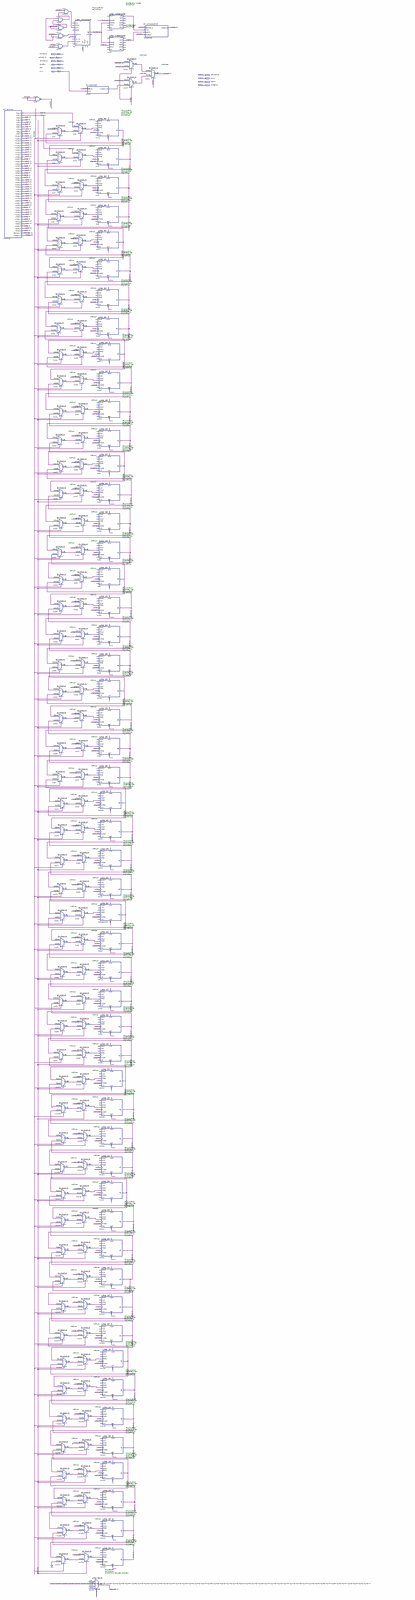
[diagram p0: schematic sheet, whole]
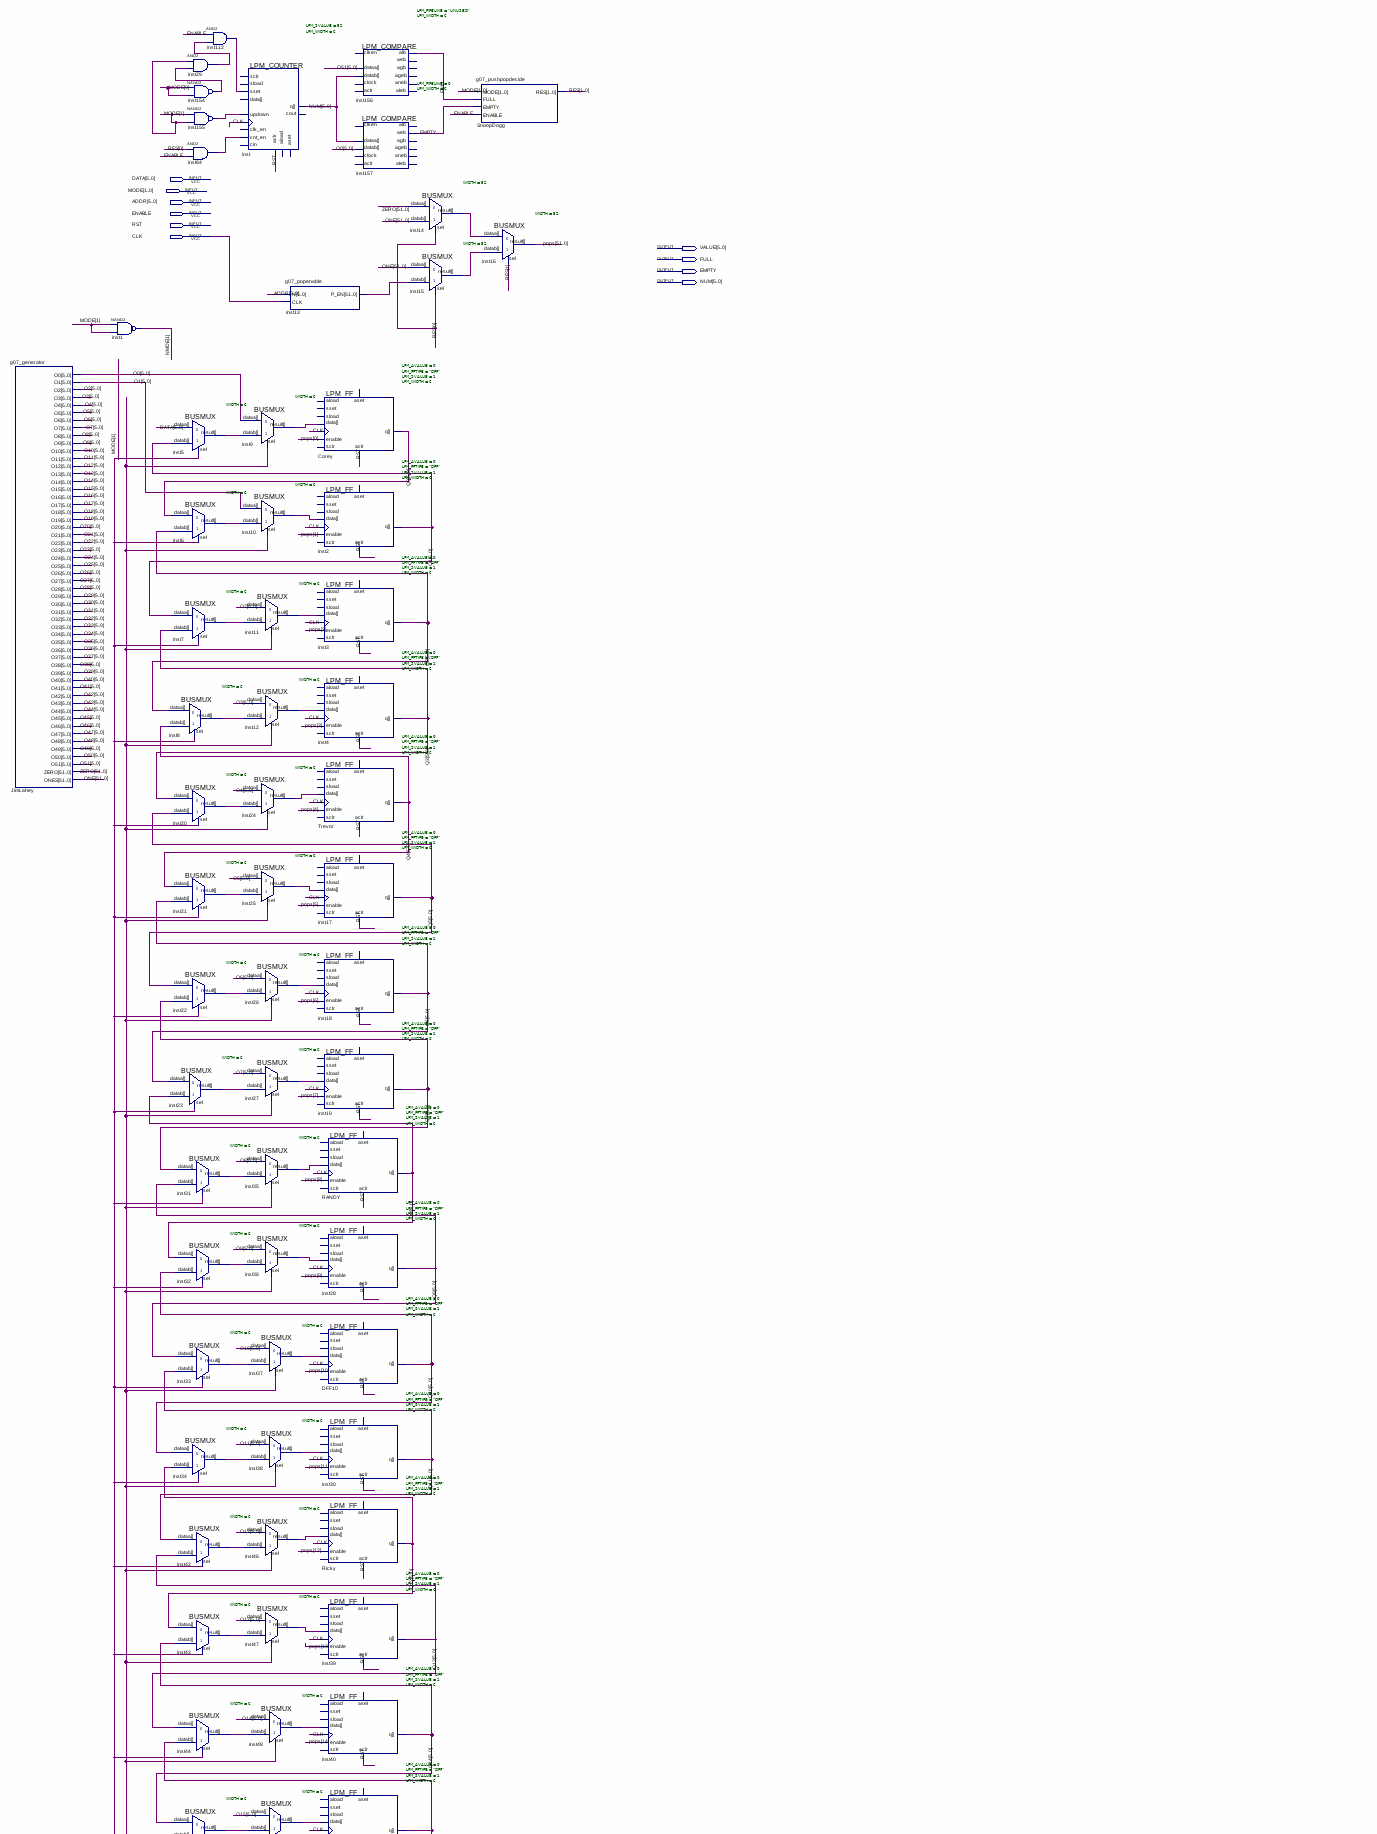
[diagram p1: schematic sheet, upper part]
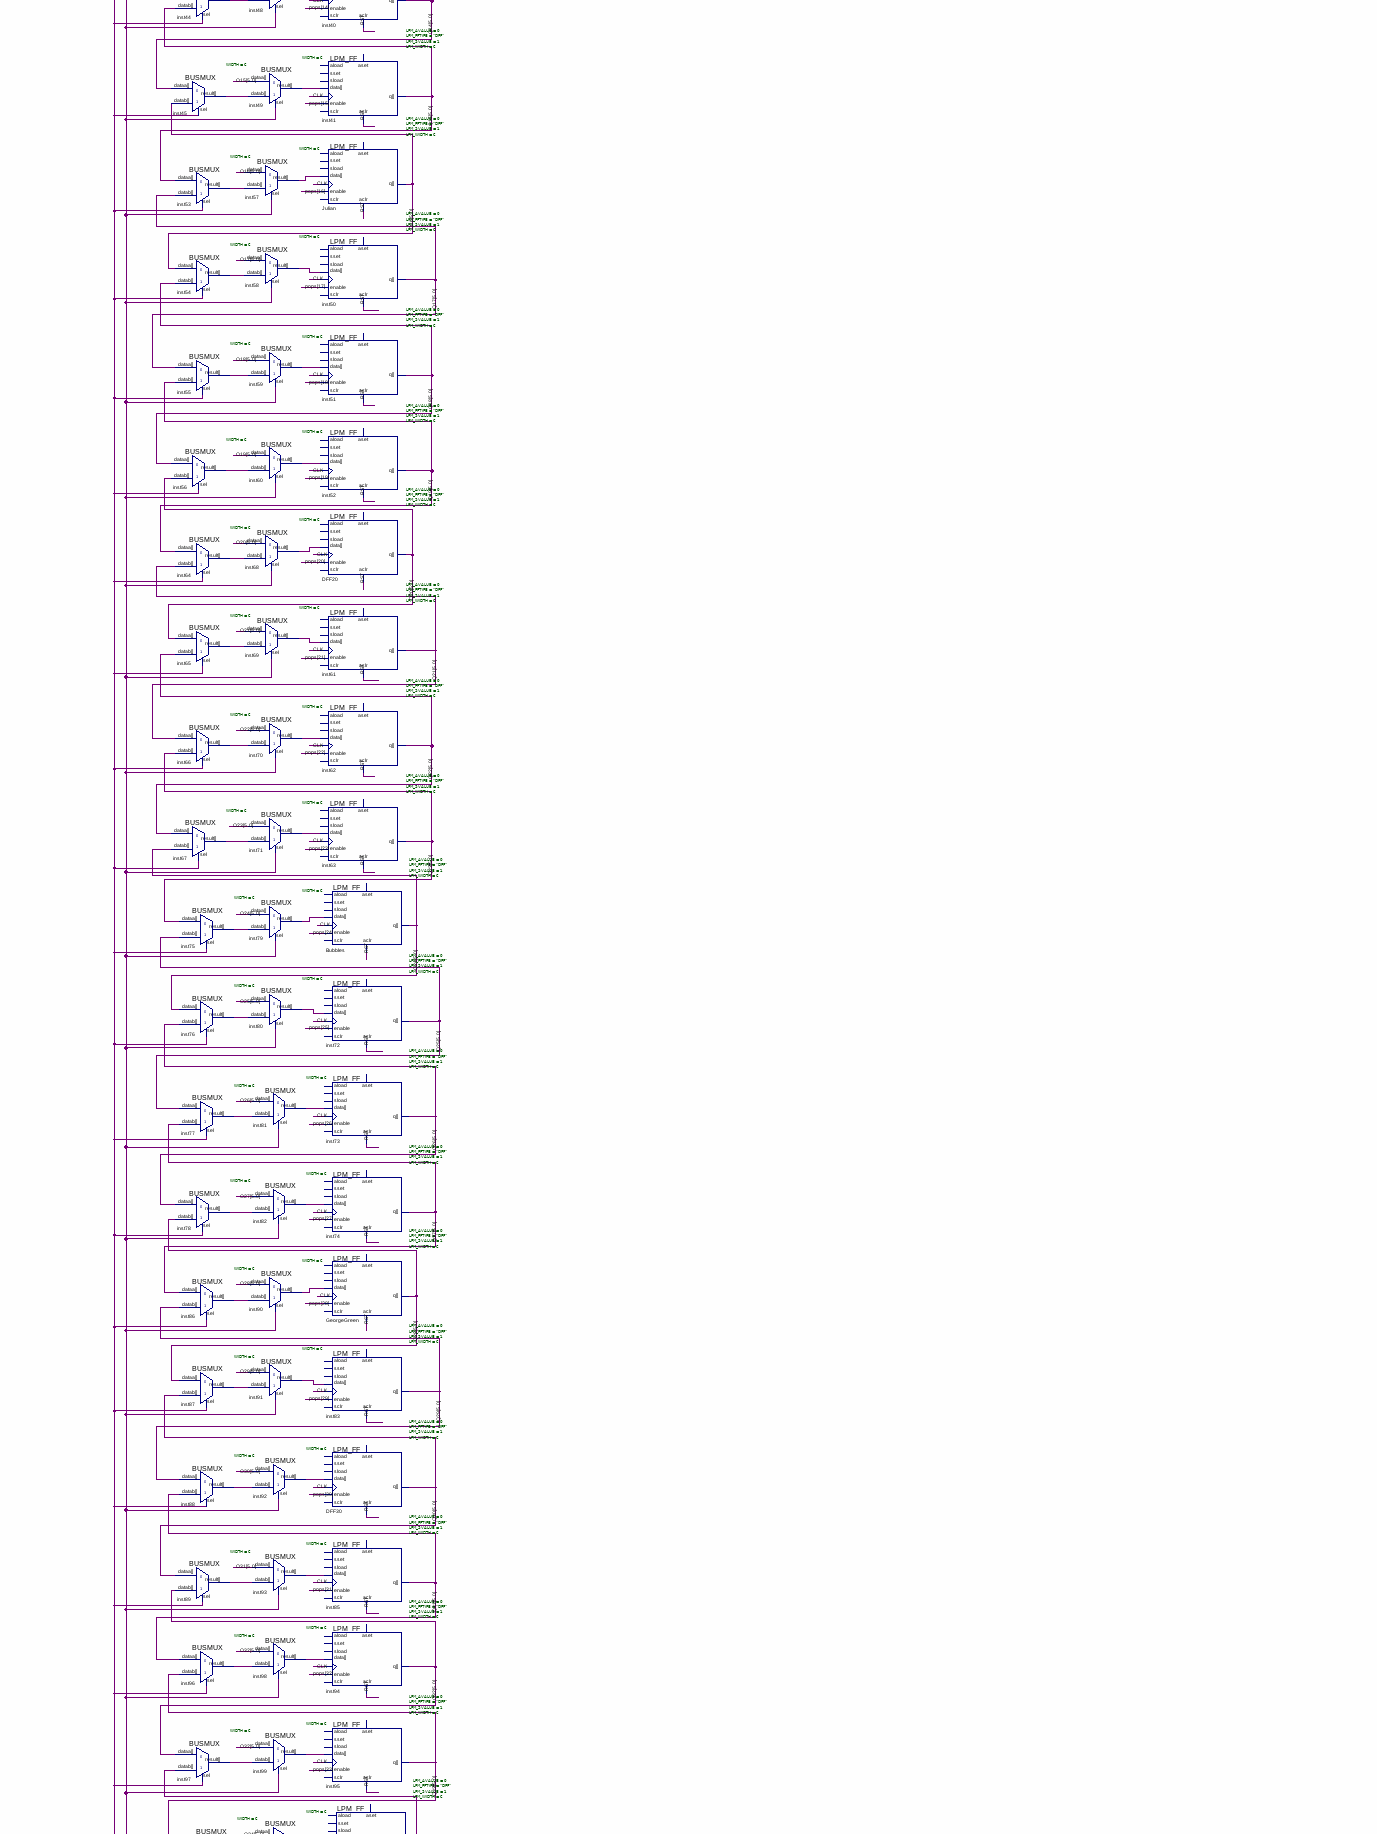
[diagram p2: schematic sheet, middle part]
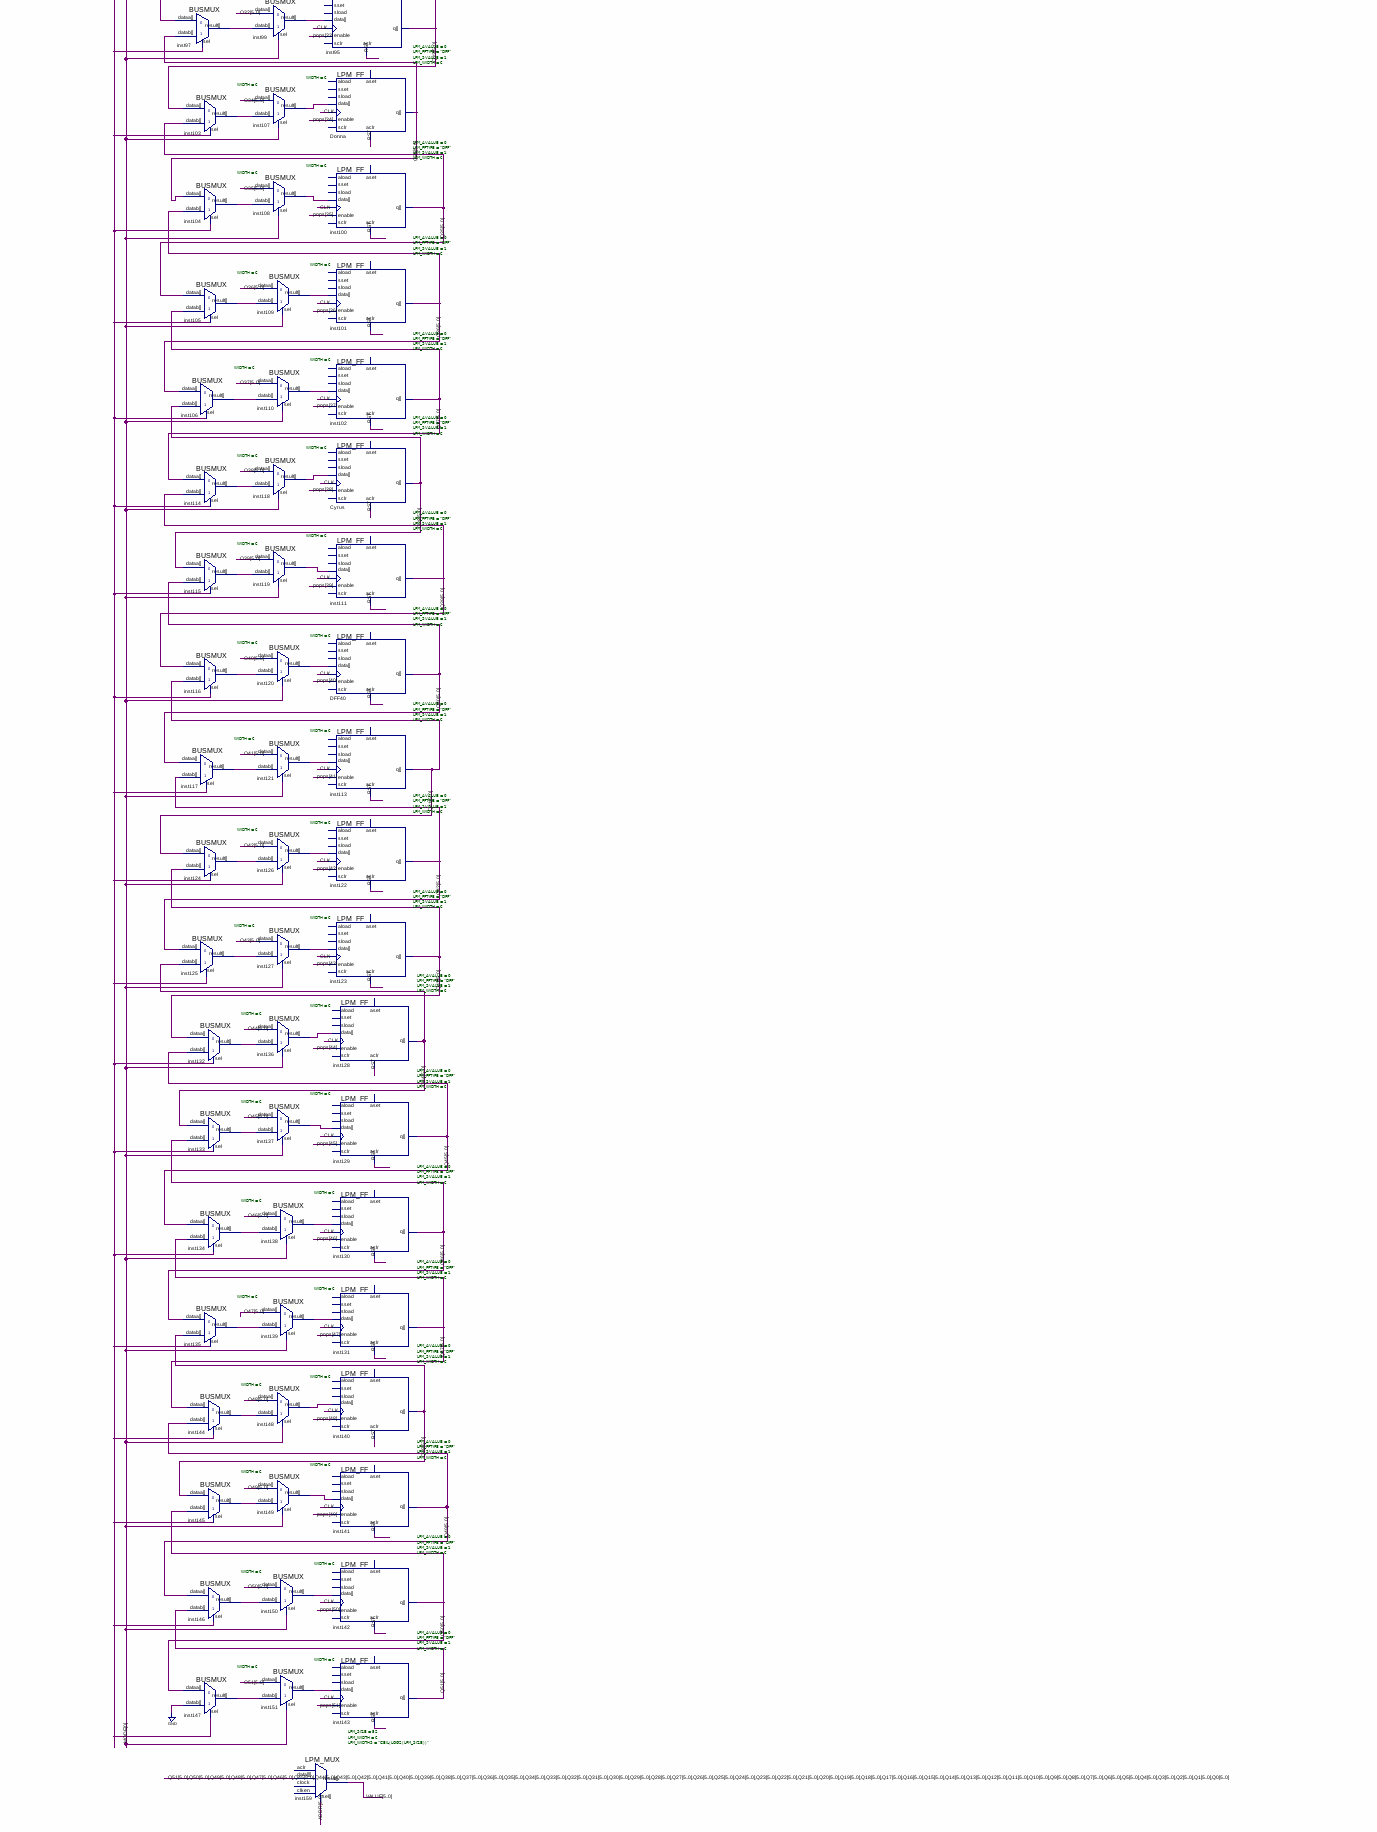
[diagram p3: schematic sheet, lower part]
// Quartus schematic g07_stack.bdf as structural Verilog: 172 symbols, 10 pins
module g07_stack (
  input  [5:0] DATA,
  input  [1:0] MODE,
  input  [5:0] ADDR,
  input  ENABLE,
  input  RST,
  input  CLK,
  output [5:0] VALUE,
  output FULL,
  output EMPTY,
  output [5:0] NUM
);

  wire inst29_out, inst84_out, inst112_out, inst154_out, inst155_out;
  wire [1:0] RES;
  wire [1:1] NMDE;
  wire [5:0] inst5_result, inst6_result, inst7_result, inst8_result, inst9_result, inst10_result,
       inst11_result, inst12_result, inst20_result, inst21_result, inst22_result, inst23_result,
       inst24_result, inst25_result, inst26_result, inst27_result, inst31_result, inst32_result,
       inst33_result, inst34_result, inst35_result, inst36_result, inst37_result, inst38_result,
       inst42_result, inst43_result, inst44_result, inst45_result, inst46_result, inst47_result,
       inst48_result, inst49_result, inst53_result, inst54_result, inst55_result, inst56_result,
       inst57_result, inst58_result, inst59_result, inst60_result, inst64_result, inst65_result,
       inst66_result, inst67_result, inst68_result, inst69_result, inst70_result, inst71_result,
       inst75_result, inst76_result, inst77_result, inst78_result, inst79_result, inst80_result,
       inst81_result, inst82_result, inst86_result, inst87_result, inst88_result, inst89_result,
       inst90_result, inst91_result, inst92_result, inst93_result, inst96_result, inst97_result,
       inst98_result, inst99_result, inst103_result, inst104_result, inst105_result, inst106_result,
       inst107_result, inst108_result, inst109_result, inst110_result, inst114_result, inst115_result,
       inst116_result, inst117_result, inst118_result, inst119_result, inst120_result, inst121_result,
       inst124_result, inst125_result, inst126_result, inst127_result, inst132_result, inst133_result,
       inst134_result, inst135_result, inst136_result, inst137_result, inst138_result, inst139_result,
       inst144_result, inst145_result, inst146_result, inst147_result, inst148_result, inst149_result,
       inst150_result, inst151_result, O0, O1, O2, O3, O4, O5, O6, O7, O8, O9, O10, O11, O12, O13, O14, O15,
       O16, O17, O18, O19, O20, O21, O22, O23, O24, O25, O26, O27, O28, O29, O30, O31, O32, O33, O34, O35,
       O36, O37, O38, O39, O40, O41, O42, O43, O44, O45, O46, O47, O48, O49, O50, O51, Q0, Q1, Q2, Q3, Q4,
       Q5, Q6, Q7, Q8, Q9, Q10, Q11, Q12, Q13, Q14, Q15, Q16, Q17, Q18, Q19, Q20, Q21, Q22, Q23, Q24, Q25,
       Q26, Q27, Q28, Q29, Q30, Q31, Q32, Q33, Q34, Q35, Q36, Q37, Q38, Q39, Q40, Q41, Q42, Q43, Q44, Q45,
       Q46, Q47, Q48, Q49, Q50, Q51;
  wire [51:0] inst13_p_en, inst14_result, inst15_result, ONE, pops, ZERO;

  g07_generator JimLahey (
    .O0(O0), .O1(O1), .O2(O2), .O3(O3), .O4(O4), .O5(O5), .O6(O6), .O7(O7), .O8(O8), .O9(O9), .O10(O10),
    .O11(O11), .O12(O12), .O13(O13), .O14(O14), .O15(O15), .O16(O16), .O17(O17), .O18(O18), .O19(O19),
    .O20(O20), .O21(O21), .O22(O22), .O23(O23), .O24(O24), .O25(O25), .O26(O26), .O27(O27), .O28(O28),
    .O29(O29), .O30(O30), .O31(O31), .O32(O32), .O33(O33), .O34(O34), .O35(O35), .O36(O36), .O37(O37),
    .O38(O38), .O39(O39), .O40(O40), .O41(O41), .O42(O42), .O43(O43), .O44(O44), .O45(O45), .O46(O46),
    .O47(O47), .O48(O48), .O49(O49), .O50(O50), .O51(O51), .ZERO(ZERO), .ONES(ONE));
  nand inst1 (NMDE[1], MODE[1], MODE[1]);
  BUSMUX #(.WIDTH(6)) inst5 (.datab(Q1), .sel(MODE[1]), .dataa(DATA), .result(inst5_result));
  BUSMUX #(.WIDTH(6)) inst6 (.datab(Q2), .sel(MODE[1]), .dataa(Q0), .result(inst6_result));
  BUSMUX #(.WIDTH(6)) inst7 (.datab(Q3), .sel(MODE[1]), .dataa(Q1), .result(inst7_result));
  BUSMUX #(.WIDTH(6)) inst8 (.datab(Q4), .sel(MODE[1]), .dataa(Q2), .result(inst8_result));
  BUSMUX #(.WIDTH(6)) inst20 (.datab(Q5), .sel(MODE[1]), .dataa(Q3), .result(inst20_result));
  BUSMUX #(.WIDTH(6)) inst21 (.datab(Q6), .sel(MODE[1]), .dataa(Q4), .result(inst21_result));
  BUSMUX #(.WIDTH(6)) inst22 (.datab(Q7), .sel(MODE[1]), .dataa(Q5), .result(inst22_result));
  BUSMUX #(.WIDTH(6)) inst23 (.datab(Q8), .sel(MODE[1]), .dataa(Q6), .result(inst23_result));
  BUSMUX #(.WIDTH(6)) inst34 (.datab(Q12), .sel(MODE[1]), .dataa(Q10), .result(inst34_result));
  BUSMUX #(.WIDTH(6)) inst45 (.datab(Q16), .sel(MODE[1]), .dataa(Q14), .result(inst45_result));
  BUSMUX #(.WIDTH(6)) inst56 (.datab(Q20), .sel(MODE[1]), .dataa(Q18), .result(inst56_result));
  BUSMUX #(.WIDTH(6)) inst67 (.datab(Q24), .sel(MODE[1]), .dataa(Q22), .result(inst67_result));
  and inst29 (inst29_out, MODE[1], inst154_out);
  nand inst154 (inst154_out, MODE[0], MODE[0]);
  nand inst155 (inst155_out, MODE[1], MODE[1]);
  and inst84 (inst84_out, RES[0], ENABLE);
  BUSMUX #(.WIDTH(6)) inst31 (.datab(Q9), .sel(MODE[1]), .dataa(Q7), .result(inst31_result));
  BUSMUX #(.WIDTH(6)) inst32 (.datab(Q10), .sel(MODE[1]), .dataa(Q8), .result(inst32_result));
  BUSMUX #(.WIDTH(6)) inst33 (.datab(Q11), .sel(MODE[1]), .dataa(Q9), .result(inst33_result));
  BUSMUX #(.WIDTH(6)) inst42 (.datab(Q13), .sel(MODE[1]), .dataa(Q11), .result(inst42_result));
  BUSMUX #(.WIDTH(6)) inst43 (.datab(Q14), .sel(MODE[1]), .dataa(Q12), .result(inst43_result));
  BUSMUX #(.WIDTH(6)) inst44 (.datab(Q15), .sel(MODE[1]), .dataa(Q13), .result(inst44_result));
  BUSMUX #(.WIDTH(6)) inst53 (.datab(Q17), .sel(MODE[1]), .dataa(Q15), .result(inst53_result));
  BUSMUX #(.WIDTH(6)) inst54 (.datab(Q18), .sel(MODE[1]), .dataa(Q16), .result(inst54_result));
  BUSMUX #(.WIDTH(6)) inst55 (.datab(Q19), .sel(MODE[1]), .dataa(Q17), .result(inst55_result));
  BUSMUX #(.WIDTH(6)) inst64 (.datab(Q21), .sel(MODE[1]), .dataa(Q19), .result(inst64_result));
  BUSMUX #(.WIDTH(6)) inst65 (.datab(Q22), .sel(MODE[1]), .dataa(Q20), .result(inst65_result));
  BUSMUX #(.WIDTH(6)) inst66 (.datab(Q23), .sel(MODE[1]), .dataa(Q21), .result(inst66_result));
  BUSMUX #(.WIDTH(6)) inst75 (.datab(Q25), .sel(MODE[1]), .dataa(Q23), .result(inst75_result));
  BUSMUX #(.WIDTH(6)) inst76 (.datab(Q26), .sel(MODE[1]), .dataa(Q24), .result(inst76_result));
  BUSMUX #(.WIDTH(6)) inst77 (.datab(Q27), .sel(MODE[1]), .dataa(Q25), .result(inst77_result));
  BUSMUX #(.WIDTH(6)) inst78 (.datab(Q28), .sel(MODE[1]), .dataa(Q26), .result(inst78_result));
  BUSMUX #(.WIDTH(6)) inst86 (.datab(Q29), .sel(MODE[1]), .dataa(Q27), .result(inst86_result));
  BUSMUX #(.WIDTH(6)) inst87 (.datab(Q30), .sel(MODE[1]), .dataa(Q28), .result(inst87_result));
  BUSMUX #(.WIDTH(6)) inst88 (.datab(Q31), .sel(MODE[1]), .dataa(Q29), .result(inst88_result));
  BUSMUX #(.WIDTH(6)) inst89 (.datab(Q32), .sel(MODE[1]), .dataa(Q30), .result(inst89_result));
  BUSMUX #(.WIDTH(6)) inst96 (.datab(Q33), .sel(MODE[1]), .dataa(Q31), .result(inst96_result));
  BUSMUX #(.WIDTH(6)) inst97 (.datab(Q34), .sel(MODE[1]), .dataa(Q32), .result(inst97_result));
  BUSMUX #(.WIDTH(6)) inst103 (.datab(Q35), .sel(MODE[1]), .dataa(Q33), .result(inst103_result));
  BUSMUX #(.WIDTH(6)) inst104 (.datab(Q36), .sel(MODE[1]), .dataa(Q34), .result(inst104_result));
  BUSMUX #(.WIDTH(6)) inst105 (.datab(Q37), .sel(MODE[1]), .dataa(Q35), .result(inst105_result));
  BUSMUX #(.WIDTH(6)) inst106 (.datab(Q38), .sel(MODE[1]), .dataa(Q36), .result(inst106_result));
  BUSMUX #(.WIDTH(6)) inst114 (.datab(Q39), .sel(MODE[1]), .dataa(Q37), .result(inst114_result));
  BUSMUX #(.WIDTH(6)) inst115 (.datab(Q40), .sel(MODE[1]), .dataa(Q38), .result(inst115_result));
  BUSMUX #(.WIDTH(6)) inst116 (.datab(Q41), .sel(MODE[1]), .dataa(Q39), .result(inst116_result));
  BUSMUX #(.WIDTH(6)) inst117 (.datab(Q42), .sel(MODE[1]), .dataa(Q40), .result(inst117_result));
  BUSMUX #(.WIDTH(6)) inst124 (.datab(Q43), .sel(MODE[1]), .dataa(Q41), .result(inst124_result));
  BUSMUX #(.WIDTH(6)) inst125 (.datab(Q44), .sel(MODE[1]), .dataa(Q42), .result(inst125_result));
  BUSMUX #(.WIDTH(6)) inst132 (.datab(Q45), .sel(MODE[1]), .dataa(Q43), .result(inst132_result));
  BUSMUX #(.WIDTH(6)) inst133 (.datab(Q46), .sel(MODE[1]), .dataa(Q44), .result(inst133_result));
  BUSMUX #(.WIDTH(6)) inst134 (.datab(Q47), .sel(MODE[1]), .dataa(Q45), .result(inst134_result));
  BUSMUX #(.WIDTH(6)) inst135 (.datab(Q48), .sel(MODE[1]), .dataa(Q46), .result(inst135_result));
  BUSMUX #(.WIDTH(6)) inst144 (.datab(Q49), .sel(MODE[1]), .dataa(Q47), .result(inst144_result));
  BUSMUX #(.WIDTH(6)) inst145 (.datab(Q50), .sel(MODE[1]), .dataa(Q48), .result(inst145_result));
  BUSMUX #(.WIDTH(6)) inst146 (.datab(Q51), .sel(MODE[1]), .dataa(Q49), .result(inst146_result));
  BUSMUX #(.WIDTH(6)) inst147 (.datab({6{1'b0}}), .sel(MODE[1]), .dataa(Q50), .result(inst147_result));
  and inst112 (inst112_out, ENABLE, inst29_out);
  LPM_COUNTER #(.LPM_SVALUE(52), .LPM_WIDTH(6)) inst (
    .clock(CLK), .aclr(RST), .sset(inst112_out), .updown(inst155_out), .cnt_en(inst84_out), .q(NUM));  // open: sload, data, clk_en, aload, aset, cin, sclr, cout
  BUSMUX #(.WIDTH(6)) inst9 (.datab(inst5_result), .sel(MODE[0]), .dataa(O0), .result(inst9_result));
  BUSMUX #(.WIDTH(6)) inst10 (.datab(inst6_result), .sel(MODE[0]), .dataa(O1), .result(inst10_result));
  BUSMUX #(.WIDTH(6)) inst11 (.datab(inst7_result), .sel(MODE[0]), .dataa(O2), .result(inst11_result));
  BUSMUX #(.WIDTH(6)) inst12 (.datab(inst8_result), .sel(MODE[0]), .dataa(O3), .result(inst12_result));
  BUSMUX #(.WIDTH(6)) inst24 (.datab(inst20_result), .sel(MODE[0]), .dataa(O4), .result(inst24_result));
  BUSMUX #(.WIDTH(6)) inst25 (.datab(inst21_result), .sel(MODE[0]), .dataa(O5), .result(inst25_result));
  BUSMUX #(.WIDTH(6)) inst26 (.datab(inst22_result), .sel(MODE[0]), .dataa(O6), .result(inst26_result));
  BUSMUX #(.WIDTH(6)) inst27 (.datab(inst23_result), .sel(MODE[0]), .dataa(O7), .result(inst27_result));
  BUSMUX #(.WIDTH(6)) inst35 (.datab(inst31_result), .sel(MODE[0]), .dataa(O8), .result(inst35_result));
  BUSMUX #(.WIDTH(6)) inst36 (.datab(inst32_result), .sel(MODE[0]), .dataa(O9), .result(inst36_result));
  BUSMUX #(.WIDTH(6)) inst37 (.datab(inst33_result), .sel(MODE[0]), .dataa(O10), .result(inst37_result));
  BUSMUX #(.WIDTH(6)) inst38 (.datab(inst34_result), .sel(MODE[0]), .dataa(O11), .result(inst38_result));
  BUSMUX #(.WIDTH(6)) inst46 (.datab(inst42_result), .sel(MODE[0]), .dataa(O12), .result(inst46_result));
  BUSMUX #(.WIDTH(6)) inst47 (.datab(inst43_result), .sel(MODE[0]), .dataa(O13), .result(inst47_result));
  BUSMUX #(.WIDTH(6)) inst48 (.datab(inst44_result), .sel(MODE[0]), .dataa(O14), .result(inst48_result));
  BUSMUX #(.WIDTH(6)) inst49 (.datab(inst45_result), .sel(MODE[0]), .dataa(O15), .result(inst49_result));
  BUSMUX #(.WIDTH(6)) inst57 (.datab(inst53_result), .sel(MODE[0]), .dataa(O16), .result(inst57_result));
  BUSMUX #(.WIDTH(6)) inst58 (.datab(inst54_result), .sel(MODE[0]), .dataa(O17), .result(inst58_result));
  BUSMUX #(.WIDTH(6)) inst59 (.datab(inst55_result), .sel(MODE[0]), .dataa(O18), .result(inst59_result));
  BUSMUX #(.WIDTH(6)) inst60 (.datab(inst56_result), .sel(MODE[0]), .dataa(O19), .result(inst60_result));
  BUSMUX #(.WIDTH(6)) inst68 (.datab(inst64_result), .sel(MODE[0]), .dataa(O20), .result(inst68_result));
  BUSMUX #(.WIDTH(6)) inst69 (.datab(inst65_result), .sel(MODE[0]), .dataa(O21), .result(inst69_result));
  BUSMUX #(.WIDTH(6)) inst70 (.datab(inst66_result), .sel(MODE[0]), .dataa(O22), .result(inst70_result));
  BUSMUX #(.WIDTH(6)) inst71 (.datab(inst67_result), .sel(MODE[0]), .dataa(O23), .result(inst71_result));
  BUSMUX #(.WIDTH(6)) inst79 (.datab(inst75_result), .sel(MODE[0]), .dataa(O24), .result(inst79_result));
  BUSMUX #(.WIDTH(6)) inst80 (.datab(inst76_result), .sel(MODE[0]), .dataa(O25), .result(inst80_result));
  BUSMUX #(.WIDTH(6)) inst81 (.datab(inst77_result), .sel(MODE[0]), .dataa(O26), .result(inst81_result));
  BUSMUX #(.WIDTH(6)) inst82 (.datab(inst78_result), .sel(MODE[0]), .dataa(O27), .result(inst82_result));
  BUSMUX #(.WIDTH(6)) inst90 (.datab(inst86_result), .sel(MODE[0]), .dataa(O28), .result(inst90_result));
  BUSMUX #(.WIDTH(6)) inst91 (.datab(inst87_result), .sel(MODE[0]), .dataa(O29), .result(inst91_result));
  BUSMUX #(.WIDTH(6)) inst92 (.datab(inst88_result), .sel(MODE[0]), .dataa(O30), .result(inst92_result));
  BUSMUX #(.WIDTH(6)) inst93 (.datab(inst89_result), .sel(MODE[0]), .dataa(O31), .result(inst93_result));
  BUSMUX #(.WIDTH(6)) inst98 (.datab(inst96_result), .sel(MODE[0]), .dataa(O32), .result(inst98_result));
  BUSMUX #(.WIDTH(6)) inst99 (.datab(inst97_result), .sel(MODE[0]), .dataa(O32), .result(inst99_result));
  BUSMUX #(.WIDTH(6)) inst107 (.datab(inst103_result), .sel(MODE[0]), .dataa(O34), .result(inst107_result));
  BUSMUX #(.WIDTH(6)) inst108 (.datab(inst104_result), .sel(MODE[0]), .dataa(O35), .result(inst108_result));
  BUSMUX #(.WIDTH(6)) inst109 (.datab(inst105_result), .sel(MODE[0]), .dataa(O36), .result(inst109_result));
  BUSMUX #(.WIDTH(6)) inst110 (.datab(inst106_result), .sel(MODE[0]), .dataa(O37), .result(inst110_result));
  BUSMUX #(.WIDTH(6)) inst118 (.datab(inst114_result), .sel(MODE[0]), .dataa(O38), .result(inst118_result));
  BUSMUX #(.WIDTH(6)) inst119 (.datab(inst115_result), .sel(MODE[0]), .dataa(O39), .result(inst119_result));
  BUSMUX #(.WIDTH(6)) inst120 (.datab(inst116_result), .sel(MODE[0]), .dataa(O40), .result(inst120_result));
  BUSMUX #(.WIDTH(6)) inst121 (.datab(inst117_result), .sel(MODE[0]), .dataa(O41), .result(inst121_result));
  BUSMUX #(.WIDTH(6)) inst126 (.datab(inst124_result), .sel(MODE[0]), .dataa(O42), .result(inst126_result));
  BUSMUX #(.WIDTH(6)) inst127 (.datab(inst125_result), .sel(MODE[0]), .dataa(O43), .result(inst127_result));
  BUSMUX #(.WIDTH(6)) inst136 (.datab(inst132_result), .sel(MODE[0]), .dataa(O44), .result(inst136_result));
  BUSMUX #(.WIDTH(6)) inst137 (.datab(inst133_result), .sel(MODE[0]), .dataa(O45), .result(inst137_result));
  BUSMUX #(.WIDTH(6)) inst138 (.datab(inst134_result), .sel(MODE[0]), .dataa(O46), .result(inst138_result));
  BUSMUX #(.WIDTH(6)) inst139 (.datab(inst135_result), .sel(MODE[0]), .dataa(O47), .result(inst139_result));
  BUSMUX #(.WIDTH(6)) inst148 (.datab(inst144_result), .sel(MODE[0]), .dataa(O48), .result(inst148_result));
  BUSMUX #(.WIDTH(6)) inst149 (.datab(inst145_result), .sel(MODE[0]), .dataa(O49), .result(inst149_result));
  BUSMUX #(.WIDTH(6)) inst150 (.datab(inst146_result), .sel(MODE[0]), .dataa(O50), .result(inst150_result));
  BUSMUX #(.WIDTH(6)) inst151 (.datab(inst147_result), .sel(MODE[0]), .dataa(O51), .result(inst151_result));
  g07_popenable inst13 (.N(ADDR), .CLK(CLK), .P_EN(inst13_p_en));
  LPM_MUX #(.LPM_SIZE(52), .LPM_WIDTH(6), .LPM_WIDTHS("CEIL(LOG2(LPM_SIZE))")) inst159 (
    .data({Q51, Q50, Q49, Q48, Q47, Q46, Q45, Q44, Q43, Q42, Q41, Q40, Q39, Q38, Q37, Q36, Q35, Q34, Q33, Q32, Q31, Q30, Q29, Q28, Q27, Q26, Q25, Q24, Q23, Q22, Q21, Q20, Q19, Q18, Q17, Q16, Q15, Q14, Q13, Q12, Q11, Q10, Q9, Q8, Q7, Q6, Q5, Q4, Q3, Q2, Q1, Q0}),
    .sel(ADDR), .result(VALUE));  // open: clock, aclr, clken
  LPM_FF #(.LPM_AVALUE(0), .LPM_FFTYPE("DFF"), .LPM_SVALUE(1), .LPM_WIDTH(6)) Corey (
    .enable(pops[0]), .clock(CLK), .aclr(RST), .data(inst9_result), .q(Q0));  // open: aload, sset, sload, aset, sclr
  LPM_FF #(.LPM_AVALUE(0), .LPM_FFTYPE("DFF"), .LPM_SVALUE(1), .LPM_WIDTH(6)) inst2 (
    .enable(pops[1]), .clock(CLK), .aclr(RST), .data(inst10_result), .q(Q1));  // open: aload, sset, sload, aset, sclr
  LPM_FF #(.LPM_AVALUE(0), .LPM_FFTYPE("DFF"), .LPM_SVALUE(1), .LPM_WIDTH(6)) inst3 (
    .enable(pops[2]), .clock(CLK), .aclr(RST), .data(inst11_result), .q(Q2));  // open: aload, sset, sload, aset, sclr
  LPM_FF #(.LPM_AVALUE(0), .LPM_FFTYPE("DFF"), .LPM_SVALUE(1), .LPM_WIDTH(6)) inst4 (
    .enable(pops[3]), .clock(CLK), .aclr(RST), .data(inst12_result), .q(Q3));  // open: aload, sset, sload, aset, sclr
  LPM_FF #(.LPM_AVALUE(0), .LPM_FFTYPE("DFF"), .LPM_SVALUE(1), .LPM_WIDTH(6)) Trevor (
    .enable(pops[4]), .clock(CLK), .aclr(RST), .data(inst24_result), .q(Q4));  // open: aload, sset, sload, aset, sclr
  LPM_FF #(.LPM_AVALUE(0), .LPM_FFTYPE("DFF"), .LPM_SVALUE(1), .LPM_WIDTH(6)) inst17 (
    .enable(pops[5]), .clock(CLK), .aclr(RST), .data(inst25_result), .q(Q5));  // open: aload, sset, sload, aset, sclr
  LPM_FF #(.LPM_AVALUE(0), .LPM_FFTYPE("DFF"), .LPM_SVALUE(1), .LPM_WIDTH(6)) inst18 (
    .enable(pops[6]), .clock(CLK), .aclr(RST), .data(inst26_result), .q(Q6));  // open: aload, sset, sload, aset, sclr
  LPM_FF #(.LPM_AVALUE(0), .LPM_FFTYPE("DFF"), .LPM_SVALUE(1), .LPM_WIDTH(6)) inst19 (
    .enable(pops[7]), .clock(CLK), .aclr(RST), .data(inst27_result), .q(Q7));  // open: aload, sset, sload, aset, sclr
  LPM_FF #(.LPM_AVALUE(0), .LPM_FFTYPE("DFF"), .LPM_SVALUE(1), .LPM_WIDTH(6)) RANDY (
    .enable(pops[8]), .clock(CLK), .aclr(RST), .data(inst35_result), .q(Q8));  // open: aload, sset, sload, aset, sclr
  LPM_FF #(.LPM_AVALUE(0), .LPM_FFTYPE("DFF"), .LPM_SVALUE(1), .LPM_WIDTH(6)) inst28 (
    .enable(pops[9]), .clock(CLK), .aclr(RST), .data(inst36_result), .q(Q9));  // open: aload, sset, sload, aset, sclr
  LPM_FF #(.LPM_AVALUE(0), .LPM_FFTYPE("DFF"), .LPM_SVALUE(1), .LPM_WIDTH(6)) DFF10 (
    .enable(pops[10]), .clock(CLK), .aclr(RST), .data(inst37_result), .q(Q10));  // open: aload, sset, sload, aset, sclr
  LPM_FF #(.LPM_AVALUE(0), .LPM_FFTYPE("DFF"), .LPM_SVALUE(1), .LPM_WIDTH(6)) inst30 (
    .enable(pops[11]), .clock(CLK), .aclr(RST), .data(inst38_result), .q(Q11));  // open: aload, sset, sload, aset, sclr
  LPM_FF #(.LPM_AVALUE(0), .LPM_FFTYPE("DFF"), .LPM_SVALUE(1), .LPM_WIDTH(6)) Ricky (
    .enable(pops[12]), .clock(CLK), .aclr(RST), .data(inst46_result), .q(Q12));  // open: aload, sset, sload, aset, sclr
  LPM_FF #(.LPM_AVALUE(0), .LPM_FFTYPE("DFF"), .LPM_SVALUE(1), .LPM_WIDTH(6)) inst39 (
    .enable(pops[13]), .clock(CLK), .aclr(RST), .data(inst47_result), .q(Q13));  // open: aload, sset, sload, aset, sclr
  LPM_FF #(.LPM_AVALUE(0), .LPM_FFTYPE("DFF"), .LPM_SVALUE(1), .LPM_WIDTH(6)) inst40 (
    .enable(pops[14]), .clock(CLK), .aclr(RST), .data(inst48_result), .q(Q14));  // open: aload, sset, sload, aset, sclr
  LPM_FF #(.LPM_AVALUE(0), .LPM_FFTYPE("DFF"), .LPM_SVALUE(1), .LPM_WIDTH(6)) inst41 (
    .enable(pops[15]), .clock(CLK), .aclr(RST), .data(inst49_result), .q(Q15));  // open: aload, sset, sload, aset, sclr
  LPM_FF #(.LPM_AVALUE(0), .LPM_FFTYPE("DFF"), .LPM_SVALUE(1), .LPM_WIDTH(6)) Julian (
    .enable(pops[16]), .clock(CLK), .aclr(RST), .data(inst57_result), .q(Q16));  // open: aload, sset, sload, aset, sclr
  LPM_FF #(.LPM_AVALUE(0), .LPM_FFTYPE("DFF"), .LPM_SVALUE(1), .LPM_WIDTH(6)) inst50 (
    .enable(pops[17]), .clock(CLK), .aclr(RST), .data(inst58_result), .q(Q17));  // open: aload, sset, sload, aset, sclr
  LPM_FF #(.LPM_AVALUE(0), .LPM_FFTYPE("DFF"), .LPM_SVALUE(1), .LPM_WIDTH(6)) inst51 (
    .enable(pops[18]), .clock(CLK), .aclr(RST), .data(inst59_result), .q(Q18));  // open: aload, sset, sload, aset, sclr
  LPM_FF #(.LPM_AVALUE(0), .LPM_FFTYPE("DFF"), .LPM_SVALUE(1), .LPM_WIDTH(6)) inst52 (
    .enable(pops[19]), .clock(CLK), .aclr(RST), .data(inst60_result), .q(Q19));  // open: aload, sset, sload, aset, sclr
  LPM_FF #(.LPM_AVALUE(0), .LPM_FFTYPE("DFF"), .LPM_SVALUE(1), .LPM_WIDTH(6)) DFF20 (
    .enable(pops[20]), .clock(CLK), .aclr(RST), .data(inst68_result), .q(Q20));  // open: aload, sset, sload, aset, sclr
  LPM_FF #(.LPM_AVALUE(0), .LPM_FFTYPE("DFF"), .LPM_SVALUE(1), .LPM_WIDTH(6)) inst61 (
    .enable(pops[21]), .clock(CLK), .aclr(RST), .data(inst69_result), .q(Q21));  // open: aload, sset, sload, aset, sclr
  LPM_FF #(.LPM_AVALUE(0), .LPM_FFTYPE("DFF"), .LPM_SVALUE(1), .LPM_WIDTH(6)) inst62 (
    .enable(pops[22]), .clock(CLK), .aclr(RST), .data(inst70_result), .q(Q22));  // open: aload, sset, sload, aset, sclr
  LPM_FF #(.LPM_AVALUE(0), .LPM_FFTYPE("DFF"), .LPM_SVALUE(1), .LPM_WIDTH(6)) inst63 (
    .enable(pops[23]), .clock(CLK), .aclr(RST), .data(inst71_result), .q(Q23));  // open: aload, sset, sload, aset, sclr
  LPM_FF #(.LPM_AVALUE(0), .LPM_FFTYPE("DFF"), .LPM_SVALUE(1), .LPM_WIDTH(6)) Bubbles (
    .enable(pops[24]), .clock(CLK), .aclr(RST), .data(inst79_result), .q(Q24));  // open: aload, sset, sload, aset, sclr
  LPM_FF #(.LPM_AVALUE(0), .LPM_FFTYPE("DFF"), .LPM_SVALUE(1), .LPM_WIDTH(6)) inst72 (
    .enable(pops[25]), .clock(CLK), .aclr(RST), .data(inst80_result), .q(Q25));  // open: aload, sset, sload, aset, sclr
  LPM_FF #(.LPM_AVALUE(0), .LPM_FFTYPE("DFF"), .LPM_SVALUE(1), .LPM_WIDTH(6)) inst73 (
    .enable(pops[26]), .clock(CLK), .aclr(RST), .data(inst81_result), .q(Q26));  // open: aload, sset, sload, aset, sclr
  LPM_FF #(.LPM_AVALUE(0), .LPM_FFTYPE("DFF"), .LPM_SVALUE(1), .LPM_WIDTH(6)) inst74 (
    .enable(pops[27]), .clock(CLK), .aclr(RST), .data(inst82_result), .q(Q27));  // open: aload, sset, sload, aset, sclr
  LPM_FF #(.LPM_AVALUE(0), .LPM_FFTYPE("DFF"), .LPM_SVALUE(1), .LPM_WIDTH(6)) GeorgeGreen (
    .enable(pops[28]), .clock(CLK), .aclr(RST), .data(inst90_result), .q(Q28));  // open: aload, sset, sload, aset, sclr
  LPM_FF #(.LPM_AVALUE(0), .LPM_FFTYPE("DFF"), .LPM_SVALUE(1), .LPM_WIDTH(6)) inst83 (
    .enable(pops[29]), .clock(CLK), .aclr(RST), .data(inst91_result), .q(Q29));  // open: aload, sset, sload, aset, sclr
  LPM_FF #(.LPM_AVALUE(0), .LPM_FFTYPE("DFF"), .LPM_SVALUE(1), .LPM_WIDTH(6)) DFF30 (
    .enable(pops[30]), .clock(CLK), .aclr(RST), .data(inst92_result), .q(Q30));  // open: aload, sset, sload, aset, sclr
  LPM_FF #(.LPM_AVALUE(0), .LPM_FFTYPE("DFF"), .LPM_SVALUE(1), .LPM_WIDTH(6)) inst85 (
    .enable(pops[31]), .clock(CLK), .aclr(RST), .data(inst93_result), .q(Q31));  // open: aload, sset, sload, aset, sclr
  LPM_FF #(.LPM_AVALUE(0), .LPM_FFTYPE("DFF"), .LPM_SVALUE(1), .LPM_WIDTH(6)) inst94 (
    .enable(pops[32]), .clock(CLK), .aclr(RST), .data(inst98_result), .q(Q32));  // open: aload, sset, sload, aset, sclr
  LPM_FF #(.LPM_AVALUE(0), .LPM_FFTYPE("DFF"), .LPM_SVALUE(1), .LPM_WIDTH(6)) inst95 (
    .enable(pops[33]), .clock(CLK), .aclr(RST), .data(inst99_result), .q(Q33));  // open: aload, sset, sload, aset, sclr
  LPM_COMPARE #(.LPM_PIPELINE("UNUSED"), .LPM_WIDTH(6)) inst156 (
    .dataa(O51), .datab(NUM), .alb(FULL));  // open: clock, aclr, clken, aleb, aeb, agb, aneb, ageb
  LPM_COMPARE #(.LPM_PIPELINE(0), .LPM_WIDTH(6)) inst157 (
    .dataa(NUM), .datab(O0), .aeb(EMPTY));  // open: clock, aclr, clken, aleb, agb, aneb, ageb, alb
  LPM_FF #(.LPM_AVALUE(0), .LPM_FFTYPE("DFF"), .LPM_SVALUE(1), .LPM_WIDTH(6)) Donna (
    .enable(pops[34]), .clock(CLK), .aclr(RST), .data(inst107_result), .q(Q34));  // open: aload, sset, sload, aset, sclr
  LPM_FF #(.LPM_AVALUE(0), .LPM_FFTYPE("DFF"), .LPM_SVALUE(1), .LPM_WIDTH(6)) inst100 (
    .enable(pops[35]), .clock(CLK), .aclr(RST), .data(inst108_result), .q(Q35));  // open: aload, sset, sload, aset, sclr
  LPM_FF #(.LPM_AVALUE(0), .LPM_FFTYPE("DFF"), .LPM_SVALUE(1), .LPM_WIDTH(6)) inst101 (
    .enable(pops[36]), .clock(CLK), .aclr(RST), .data(inst109_result), .q(Q36));  // open: aload, sset, sload, aset, sclr
  LPM_FF #(.LPM_AVALUE(0), .LPM_FFTYPE("DFF"), .LPM_SVALUE(1), .LPM_WIDTH(6)) inst102 (
    .enable(pops[37]), .clock(CLK), .aclr(RST), .data(inst110_result), .q(Q37));  // open: aload, sset, sload, aset, sclr
  LPM_FF #(.LPM_AVALUE(0), .LPM_FFTYPE("DFF"), .LPM_SVALUE(1), .LPM_WIDTH(6)) Cyrus (
    .enable(pops[38]), .clock(CLK), .aclr(RST), .data(inst118_result), .q(Q38));  // open: aload, sset, sload, aset, sclr
  LPM_FF #(.LPM_AVALUE(0), .LPM_FFTYPE("DFF"), .LPM_SVALUE(1), .LPM_WIDTH(6)) inst111 (
    .enable(pops[39]), .clock(CLK), .aclr(RST), .data(inst119_result), .q(Q39));  // open: aload, sset, sload, aset, sclr
  LPM_FF #(.LPM_AVALUE(0), .LPM_FFTYPE("DFF"), .LPM_SVALUE(1), .LPM_WIDTH(6)) DFF40 (
    .enable(pops[40]), .clock(CLK), .aclr(RST), .data(inst120_result), .q(Q40));  // open: aload, sset, sload, aset, sclr
  LPM_FF #(.LPM_AVALUE(0), .LPM_FFTYPE("DFF"), .LPM_SVALUE(1), .LPM_WIDTH(6)) inst113 (
    .enable(pops[41]), .clock(CLK), .aclr(RST), .data(inst121_result), .q(Q41));  // open: aload, sset, sload, aset, sclr
  LPM_FF #(.LPM_AVALUE(0), .LPM_FFTYPE("DFF"), .LPM_SVALUE(1), .LPM_WIDTH(6)) inst122 (
    .enable(pops[42]), .clock(CLK), .aclr(RST), .data(inst126_result), .q(Q42));  // open: aload, sset, sload, aset, sclr
  LPM_FF #(.LPM_AVALUE(0), .LPM_FFTYPE("DFF"), .LPM_SVALUE(1), .LPM_WIDTH(6)) inst123 (
    .enable(pops[43]), .clock(CLK), .aclr(RST), .data(inst127_result), .q(Q43));  // open: aload, sset, sload, aset, sclr
  LPM_FF #(.LPM_AVALUE(0), .LPM_FFTYPE("DFF"), .LPM_SVALUE(1), .LPM_WIDTH(6)) inst128 (
    .enable(pops[44]), .clock(CLK), .aclr(RST), .data(inst136_result), .q(Q44));  // open: aload, sset, sload, aset, sclr
  LPM_FF #(.LPM_AVALUE(0), .LPM_FFTYPE("DFF"), .LPM_SVALUE(1), .LPM_WIDTH(6)) inst129 (
    .enable(pops[45]), .clock(CLK), .aclr(RST), .data(inst137_result), .q(Q45));  // open: aload, sset, sload, aset, sclr
  LPM_FF #(.LPM_AVALUE(0), .LPM_FFTYPE("DFF"), .LPM_SVALUE(1), .LPM_WIDTH(6)) inst130 (
    .enable(pops[46]), .clock(CLK), .aclr(RST), .data(inst138_result), .q(Q46));  // open: aload, sset, sload, aset, sclr
  LPM_FF #(.LPM_AVALUE(0), .LPM_FFTYPE("DFF"), .LPM_SVALUE(1), .LPM_WIDTH(6)) inst131 (
    .enable(pops[47]), .clock(CLK), .aclr(RST), .data(inst139_result), .q(Q47));  // open: aload, sset, sload, aset, sclr
  LPM_FF #(.LPM_AVALUE(0), .LPM_FFTYPE("DFF"), .LPM_SVALUE(1), .LPM_WIDTH(6)) inst140 (
    .enable(pops[48]), .clock(CLK), .aclr(RST), .data(inst148_result), .q(Q48));  // open: aload, sset, sload, aset, sclr
  LPM_FF #(.LPM_AVALUE(0), .LPM_FFTYPE("DFF"), .LPM_SVALUE(1), .LPM_WIDTH(6)) inst141 (
    .enable(pops[49]), .clock(CLK), .aclr(RST), .data(inst149_result), .q(Q49));  // open: aload, sset, sload, aset, sclr
  LPM_FF #(.LPM_AVALUE(0), .LPM_FFTYPE("DFF"), .LPM_SVALUE(1), .LPM_WIDTH(6)) inst142 (
    .enable(pops[50]), .clock(CLK), .aclr(RST), .data(inst150_result), .q(Q50));  // open: aload, sset, sload, aset, sclr
  LPM_FF #(.LPM_AVALUE(0), .LPM_FFTYPE("DFF"), .LPM_SVALUE(1), .LPM_WIDTH(6)) inst143 (
    .enable(pops[51]), .clock(CLK), .aclr(RST), .data(inst151_result), .q(Q51));  // open: aload, sset, sload, aset, sclr
  BUSMUX #(.WIDTH(52)) inst14 (.datab(ONE), .sel(RES[0]), .dataa(ZERO), .result(inst14_result));
  BUSMUX #(.WIDTH(52)) inst15 (.datab(inst13_p_en), .sel(RES[0]), .dataa(ONE), .result(inst15_result));
  g07_pushpopdecide SnoopDogg (.MODE(MODE), .FULL(FULL), .EMPTY(EMPTY), .ENABLE(ENABLE), .RES(RES));
  BUSMUX #(.WIDTH(52)) inst16 (.datab(inst15_result), .sel(RES[1]), .dataa(inst14_result), .result(pops));
endmodule
